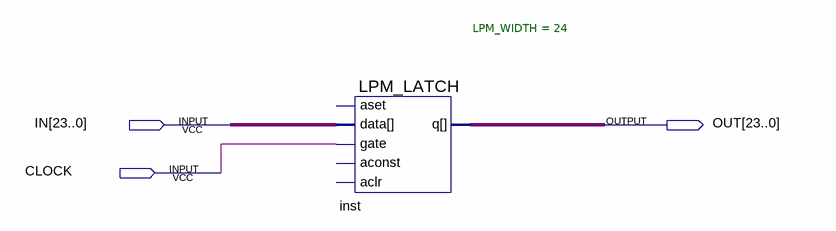
[diagram p0: schematic sheet]
// Quartus schematic CONTROL_PIPE.bdf as structural Verilog: 1 symbols, 3 pins
module CONTROL_PIPE (
  input  [23:0] IN,
  input  CLOCK,
  output [23:0] OUT
);

  LPM_LATCH #(.LPM_WIDTH(24)) inst (.data(IN), .gate(CLOCK), .q(OUT));  // open: aset, aconst, aclr
endmodule
